# Altium schematic sheet OR_Gate.SchDoc
size 420 x 297 mm; SheetNumber: 18; SheetTotal: 23
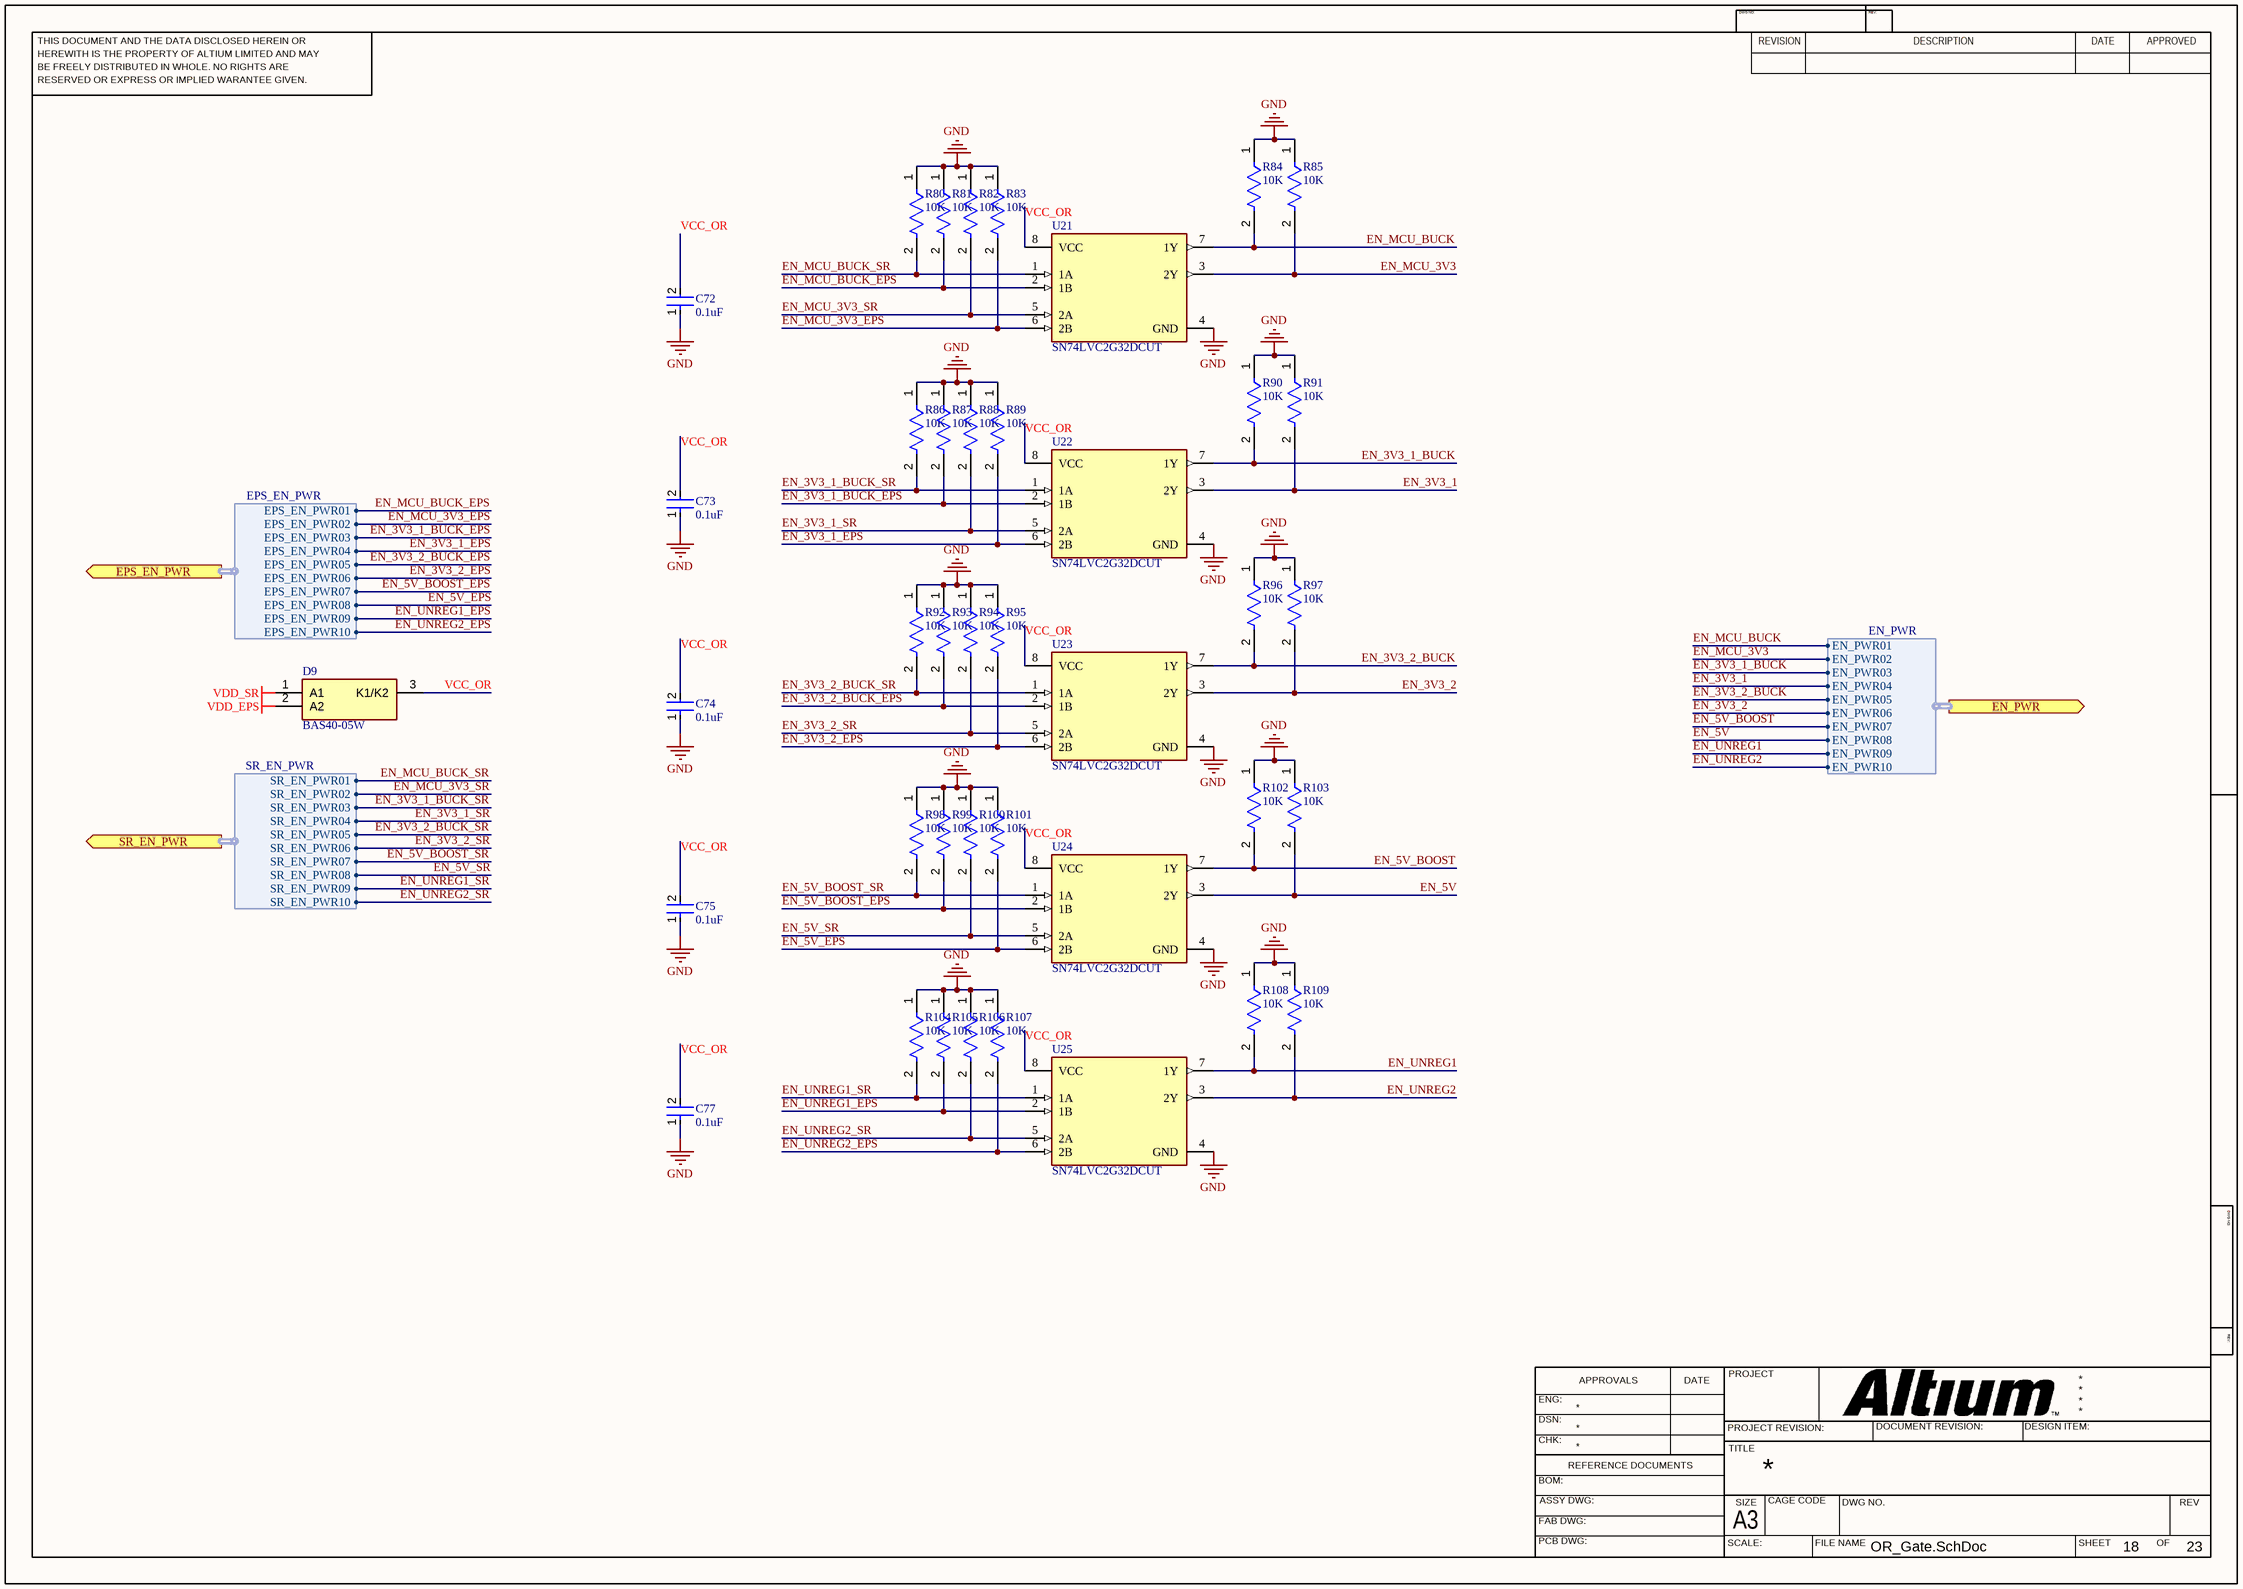
[diagram p0: OR_Gate.SchDoc]

## Parts
C72  0.1uF  [FP-C0603C-CF-MFG]
C73  0.1uF  [FP-C0603C-CF-MFG]
C74  0.1uF  [FP-C0603C-CF-MFG]
C75  0.1uF  [FP-C0603C-CF-MFG]
C77  0.1uF  [FP-C0603C-CF-MFG]
D9  BAS40-05W  [SOT65P210X110-3N]
R80  10K  [FP-RK73B1J-MFG]
R81  10K  [FP-RK73B1J-MFG]
R82  10K  [FP-RK73B1J-MFG]
R83  10K  [FP-RK73B1J-MFG]
R84  10K  [FP-RK73B1J-MFG]
R85  10K  [FP-RK73B1J-MFG]
R86  10K  [FP-RK73B1J-MFG]
R87  10K  [FP-RK73B1J-MFG]
R88  10K  [FP-RK73B1J-MFG]
R89  10K  [FP-RK73B1J-MFG]
R90  10K  [FP-RK73B1J-MFG]
R91  10K  [FP-RK73B1J-MFG]
R92  10K  [FP-RK73B1J-MFG]
R93  10K  [FP-RK73B1J-MFG]
R94  10K  [FP-RK73B1J-MFG]
R95  10K  [FP-RK73B1J-MFG]
R96  10K  [FP-RK73B1J-MFG]
R97  10K  [FP-RK73B1J-MFG]
R98  10K  [FP-RK73B1J-MFG]
R99  10K  [FP-RK73B1J-MFG]
R100  10K  [FP-RK73B1J-MFG]
R101  10K  [FP-RK73B1J-MFG]
R102  10K  [FP-RK73B1J-MFG]
R103  10K  [FP-RK73B1J-MFG]
R104  10K  [FP-RK73B1J-MFG]
R105  10K  [FP-RK73B1J-MFG]
R106  10K  [FP-RK73B1J-MFG]
R107  10K  [FP-RK73B1J-MFG]
R108  10K  [FP-RK73B1J-MFG]
R109  10K  [FP-RK73B1J-MFG]
U21  SN74LVC2G32DCUT  [FP-DCU0008A-IPC_B]
U22  SN74LVC2G32DCUT  [FP-DCU0008A-IPC_B]
U23  SN74LVC2G32DCUT  [FP-DCU0008A-IPC_B]
U24  SN74LVC2G32DCUT  [FP-DCU0008A-IPC_B]
U25  SN74LVC2G32DCUT  [FP-DCU0008A-IPC_B]

## Ports
EN_PWR (out, harness EN_PWR), EPS_EN_PWR (out, harness EPS_EN_PWR), SR_EN_PWR (out, harness SR_EN_PWR)

## Harnesses
EPS_EN_PWR: EPS_EN_PWR01, EPS_EN_PWR02, EPS_EN_PWR03, EPS_EN_PWR04, EPS_EN_PWR05, EPS_EN_PWR06, EPS_EN_PWR07, EPS_EN_PWR08, EPS_EN_PWR09, EPS_EN_PWR10
SR_EN_PWR: SR_EN_PWR01, SR_EN_PWR02, SR_EN_PWR03, SR_EN_PWR04, SR_EN_PWR05, SR_EN_PWR06, SR_EN_PWR07, SR_EN_PWR08, SR_EN_PWR09, SR_EN_PWR10
EN_PWR: EN_PWR01, EN_PWR02, EN_PWR03, EN_PWR04, EN_PWR05, EN_PWR06, EN_PWR07, EN_PWR08, EN_PWR09, EN_PWR10

## Nets
GND: C72.1 C73.1 C74.1 C75.1 C77.1 R80.1 R81.1 R82.1 R83.1 R84.1 R85.1 R86.1 R87.1 R88.1 R89.1 R90.1 R91.1 R92.1 R93.1 R94.1 R95.1 R96.1 R97.1 R98.1 R99.1 R100.1 R101.1 R102.1 R103.1 R104.1 R105.1 R106.1 R107.1 R108.1 R109.1 U21.4(GND) U22.4(GND) U23.4(GND) U24.4(GND) U25.4(GND)
VDD_EPS: D9.2(A2)
VDD_SR: D9.1(A1)
EN_3V3_1: R91.2 U22.3(2Y) ; port EN_PWR.EN_PWR04
EN_3V3_1_BUCK: R90.2 U22.7(1Y) ; port EN_PWR.EN_PWR03
EN_3V3_1_BUCK_EPS: R87.2 U22.2(1B) ; port EPS_EN_PWR.EPS_EN_PWR03
EN_3V3_1_BUCK_SR: R86.2 U22.1(1A) ; port SR_EN_PWR.SR_EN_PWR03
EN_3V3_1_EPS: R89.2 U22.6(2B) ; port EPS_EN_PWR.EPS_EN_PWR04
EN_3V3_1_SR: R88.2 U22.5(2A) ; port SR_EN_PWR.SR_EN_PWR04
EN_3V3_2: R97.2 U23.3(2Y) ; port EN_PWR.EN_PWR06
EN_3V3_2_BUCK: R96.2 U23.7(1Y) ; port EN_PWR.EN_PWR05
EN_3V3_2_BUCK_EPS: R93.2 U23.2(1B) ; port EPS_EN_PWR.EPS_EN_PWR05
EN_3V3_2_BUCK_SR: R92.2 U23.1(1A) ; port SR_EN_PWR.SR_EN_PWR05
EN_3V3_2_EPS: R95.2 U23.6(2B) ; port EPS_EN_PWR.EPS_EN_PWR06
EN_3V3_2_SR: R94.2 U23.5(2A) ; port SR_EN_PWR.SR_EN_PWR06
EN_5V: R103.2 U24.3(2Y) ; port EN_PWR.EN_PWR08
EN_5V_BOOST: R102.2 U24.7(1Y) ; port EN_PWR.EN_PWR07
EN_5V_BOOST_EPS: R99.2 U24.2(1B) ; port EPS_EN_PWR.EPS_EN_PWR07
EN_5V_BOOST_SR: R98.2 U24.1(1A) ; port SR_EN_PWR.SR_EN_PWR07
EN_5V_EPS: R101.2 U24.6(2B) ; port EPS_EN_PWR.EPS_EN_PWR08
EN_5V_SR: R100.2 U24.5(2A) ; port SR_EN_PWR.SR_EN_PWR08
EN_MCU_3V3: R85.2 U21.3(2Y) ; port EN_PWR.EN_PWR02
EN_MCU_3V3_EPS: R83.2 U21.6(2B) ; port EPS_EN_PWR.EPS_EN_PWR02
EN_MCU_3V3_SR: R82.2 U21.5(2A) ; port SR_EN_PWR.SR_EN_PWR02
EN_MCU_BUCK: R84.2 U21.7(1Y) ; port EN_PWR.EN_PWR01
EN_MCU_BUCK_EPS: R81.2 U21.2(1B) ; port EPS_EN_PWR.EPS_EN_PWR01
EN_MCU_BUCK_SR: R80.2 U21.1(1A) ; port SR_EN_PWR.SR_EN_PWR01
EN_UNREG1: R108.2 U25.7(1Y) ; port EN_PWR.EN_PWR09
EN_UNREG1_EPS: R105.2 U25.2(1B) ; port EPS_EN_PWR.EPS_EN_PWR09
EN_UNREG1_SR: R104.2 U25.1(1A) ; port SR_EN_PWR.SR_EN_PWR09
EN_UNREG2: R109.2 U25.3(2Y) ; port EN_PWR.EN_PWR10
EN_UNREG2_EPS: R107.2 U25.6(2B) ; port EPS_EN_PWR.EPS_EN_PWR10
EN_UNREG2_SR: R106.2 U25.5(2A) ; port SR_EN_PWR.SR_EN_PWR10
VCC_OR: C72.2 C73.2 C74.2 C75.2 C77.2 D9.3(K1/K2) U21.8(VCC) U22.8(VCC) U23.8(VCC) U24.8(VCC) U25.8(VCC)

## Notes on the sheet
- THIS DOCUMENT AND THE DATA DISCLOSED HEREIN OR
- HEREWITH IS THE PROPERTY OF ALTIUM LIMITED AND MAY
- DWG NO:
- REVISION
- REV:
- DESCRIPTION
- DATE
- APPROVED
- BE FREELY DISTRIBUTED IN WHOLE. NO RIGHTS ARE
- RESERVED OR EXPRESS OR IMPLIED WARANTEE GIVEN.
- ENG:
- APPROVALS
- PROJECT
- DSN:
- CHK:
- REFERENCE DOCUMENTS
- PROJECT REVISION:
- TITLE
- DOCUMENT REVISION:
- DESIGN ITEM:
- BOM:
- FAB DWG:
- PCB DWG:
- ASSY DWG:
- SCALE:
- A3
- SIZE
- CAGE CODE
- FILE NAME
- DWG NO.
- SHEET
- OF
- REV

## Library data of the parts
C72-C75 C77 = CMP-2006-03061-2: CAP CER 0.1UF 50V X7R 0603; Manufacturer: KEMET; Manufacturer Part Number: C0603C104K5RACTU; Tolerance: 0.1; Temperature Coefficient: 30ppm/°C; Material: Ceramic; Automotive Grade: Grade 1; Value: 0.10 μF; Temperature: -55°C to +125°C; RoHS: TRUE; Temperature Range High: +125°C; Lead Free: Yes; Octopart: https://octopart.com/c0603c104k5ractu-kemet-139244; Digikey Description: CAP CER 0.1UF 50V X7R 0603; Category: Cap; Package: C0603C-CF; ComponentLink2Description: Datasheet; Temperature Range Low: -55°C; Device Class L1: Passive Components; Voltage Rating: 50 V; Automotive: Yes; Device Class L3: Ceramic Capacitors; ComponentLink2URL: https://api.kemet.com/component-edge/download/datasheet/C0603C100J5GACAUTO.pdf; Capacitance: 0.10 μF; Device Class L2: Capacitors; Temperature Characteristic: X7R; Height: 0.87mm
D9 = BAS40-05W: Integrated Circuit; Manufacturer_Name: Nexperia; Datasheet Link: https://datasheet.datasheetarchive.com/originals/distributors/Datasheets-SFU1/DSASFU100010083.pdf; Height: 1.1mm; Manufacturer_Part_Number: BAS40-05W; Mouser Part Number: N/A; Mouser Price/Stock: https://www.mouser.co.uk/ProductDetail/Nexperia/BAS40-05W?qs=vHuUswq2%252BsxKDyywan0sHA%3D%3D
R80-R109 = CMP-2000-01851-2: RES 10K OHM 5% 1/10W 0603; Temperature Coefficient: 200ppm/°C; Voltage Rating: 50V; Power Rating: 100mW; Resistance: 10kR; Length: 1.6mm; Lead Free: Lead Free; Resistance Tolerance: 5%; Case Code (Metric): 1608; Width: 0.8mm; Height: 0.45mm; Max Operating Temperature: 155°C; RoHS Compliant: Yes; Resistor Type: Thick Film; Min Operating Temperature: -55°C; Case Code (Imperial): 0603; Technology: THICK FILM; Package Quantity: 5000; Tolerance: 5%; Case/Package: 0603; Voltage Rating (DC): 50V; Depth: 0.8mm; Packaging: Tape and Reel; Number of Pins: 2; Construction: Rectangular; Series: RK73B; Military Standard: Not; Termination: SMD/SMT
U21-U25 = CMP-0859-00599-4: IC GATE OR 2CH 2-INP 8VSSOP; Number of Input Lines: 2; Operating Supply Voltage: 3.3V; Max Supply Voltage: 5.5V; Quiescent Current: 10uA; Min Supply Voltage: 1.65V; Number of Output Lines: 1; Turn-On Delay Time: 3.2ns; High Level Output Current: -32mA; Low Level Output Current: 32mA; Logic Function: OR GATE; Number of Bits: 2; Number of Pins: 8; REACH SVHC: No SVHC; Mount: Surface Mount; Number of Inputs: 2; Weight: 0.000339oz; Series: 74LVC; Lead Free: Lead Free; Number of Outputs: 1; Min Operating Temperature: -40°C; Termination: SMD/SMT; Number of Gates: 2; Number of Elements: 2; Package Quantity: 1; Max Operating Temperature: 125°C; Packaging: Tape and Reel; Number of Circuits: 2; Propagation Delay: 3.2ns; Case/Package: VSSOP; Radiation Hardening: No; Contact Plating: Gold; Max Output Current: 32mA; Technology: CMOS; Output Current: 32mA; RoHS Compliant: Yes